# Altium schematic sheet INDEX.SchDoc
size 420 x 297 mm; SheetNumber: 1; SheetTotal: 6
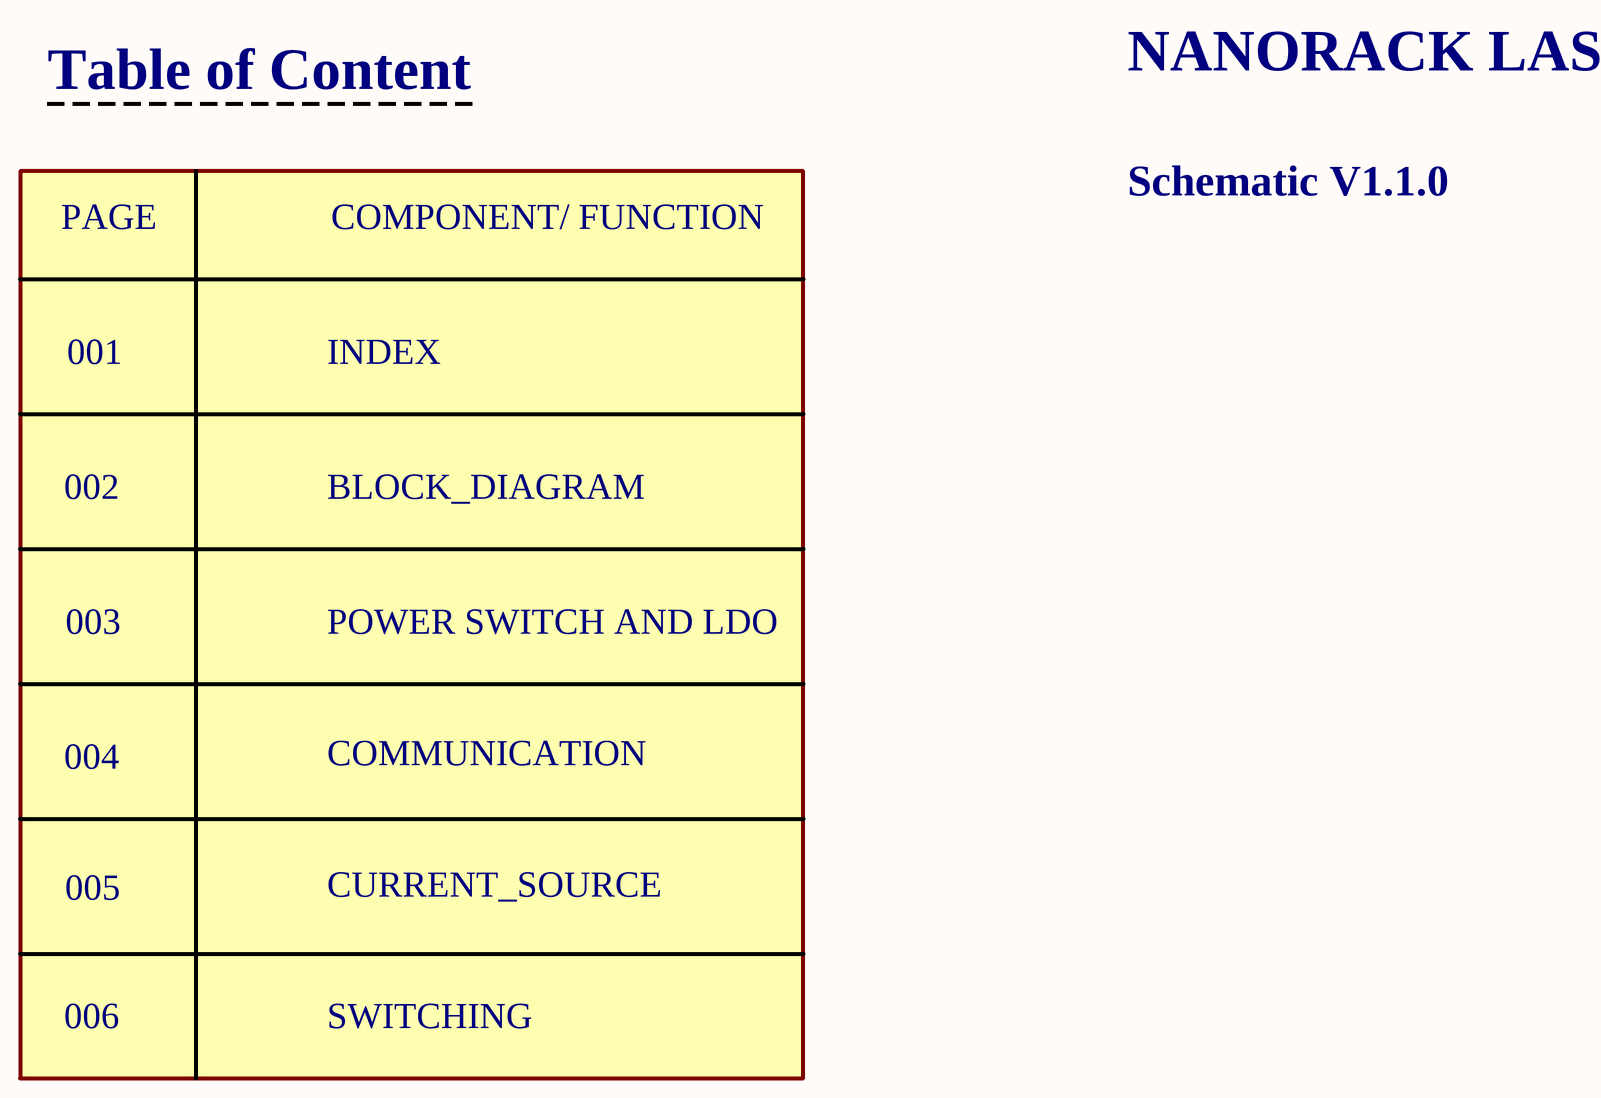
[diagram p0: INDEX.SchDoc]

## Notes on the sheet
- Table of Content
- NANORACK LASER
- PAGE
- COMPONENT/ FUNCTION
- Schematic V1.1.0
- 001
- INDEX
- 002
- BLOCK_DIAGRAM
- 003
- POWER SWITCH AND LDO
- 004
- COMMUNICATION
- 005
- CURRENT_SOURCE
- 006
- SWITCHING
- Project:
- BEE-PC1
- Sub-system:
- Design by:
- Hung Nguyen D.
- Bao Bui Q.
- Sheet title:
- Sheet
- A3
- of
- Checked by:
- Approved by:
- Vu Pham
- Revision:
- Document No:
- V1.1.0
- Size:
- Date: